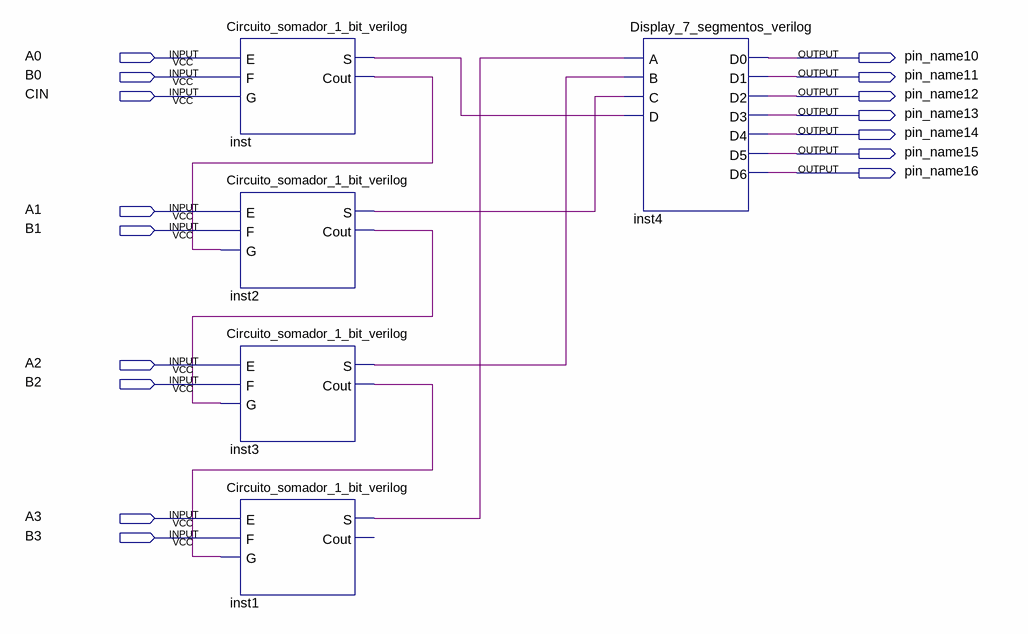
[diagram p0: schematic sheet]
// Quartus schematic Somador_Display.bdf as structural Verilog: 5 symbols, 16 pins
module Somador_Display (
  input  A0,
  input  B0,
  input  CIN,
  input  A1,
  input  B1,
  input  A2,
  input  B2,
  input  A3,
  input  B3,
  output pin_name10,
  output pin_name11,
  output pin_name12,
  output pin_name13,
  output pin_name14,
  output pin_name15,
  output pin_name16
);

  wire inst1_s, inst2_cout, inst2_s, inst3_cout, inst3_s, inst_cout, inst_s;

  Circuito_somador_1_bit_verilog inst (.E(A0), .F(B0), .G(CIN), .S(inst_s), .Cout(inst_cout));
  Circuito_somador_1_bit_verilog inst2 (.E(A1), .F(B1), .G(inst_cout), .S(inst2_s), .Cout(inst2_cout));
  Circuito_somador_1_bit_verilog inst3 (.E(A2), .F(B2), .G(inst2_cout), .S(inst3_s), .Cout(inst3_cout));
  Circuito_somador_1_bit_verilog inst1 (.E(A3), .F(B3), .G(inst3_cout), .S(inst1_s));  // open: Cout
  Display_7_segmentos_verilog inst4 (
    .A(inst1_s), .B(inst3_s), .C(inst2_s), .D(inst_s), .D0(pin_name10), .D1(pin_name11), .D2(pin_name12),
    .D3(pin_name13), .D4(pin_name14), .D5(pin_name15), .D6(pin_name16));
endmodule
